# EAGLE design workshop (EAGLE 7.3.0)
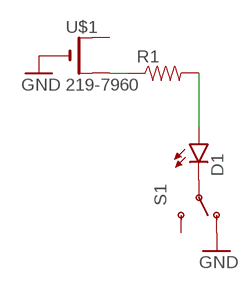
[diagram p0: schematic, sheet 1]

## Parts
D1  LED10MM  [LED10MM]
R1  RESISTORKIT  [AXIAL-0.3-KIT]
S1  SWITCH-SPDT-1  [MHS122-1]
U$1  219-7960  CR2032THM  [CR2032-THRU]

## Nets
GND: S1.1(O) U$1.-
N$1: D1.A R1.P$2
N$2: D1.C S1.2(P)
N$3: R1.P$1 U$1.+2(+1)
Unconnected: S1.3(S) U$1.+1(+)

## Library data of the parts
D1 = SparkFun-LED:LED: LEDs Standard schematic elements and footprints for 5mm, 3mm, 1206, and 0603 sized LEDs. 5mm - Spark Fun Electronics SKU : COM-00529 (and others)
R1 = SparkFun-Passives:RESISTOR: Resistor Basic schematic elements and footprints for 0603, 1206, and PTH resistors.
S1 = lio:SWITCH-SPDT: SPDT Switch Simple slide switch, Spark Fun Electronics SKU : COM-00102 DPDT SMT slide switch, AYZ0202, SWCH-08179
U$1 = adafruit:CR2032

## Net classes
0 default: width 1 mm

## Board
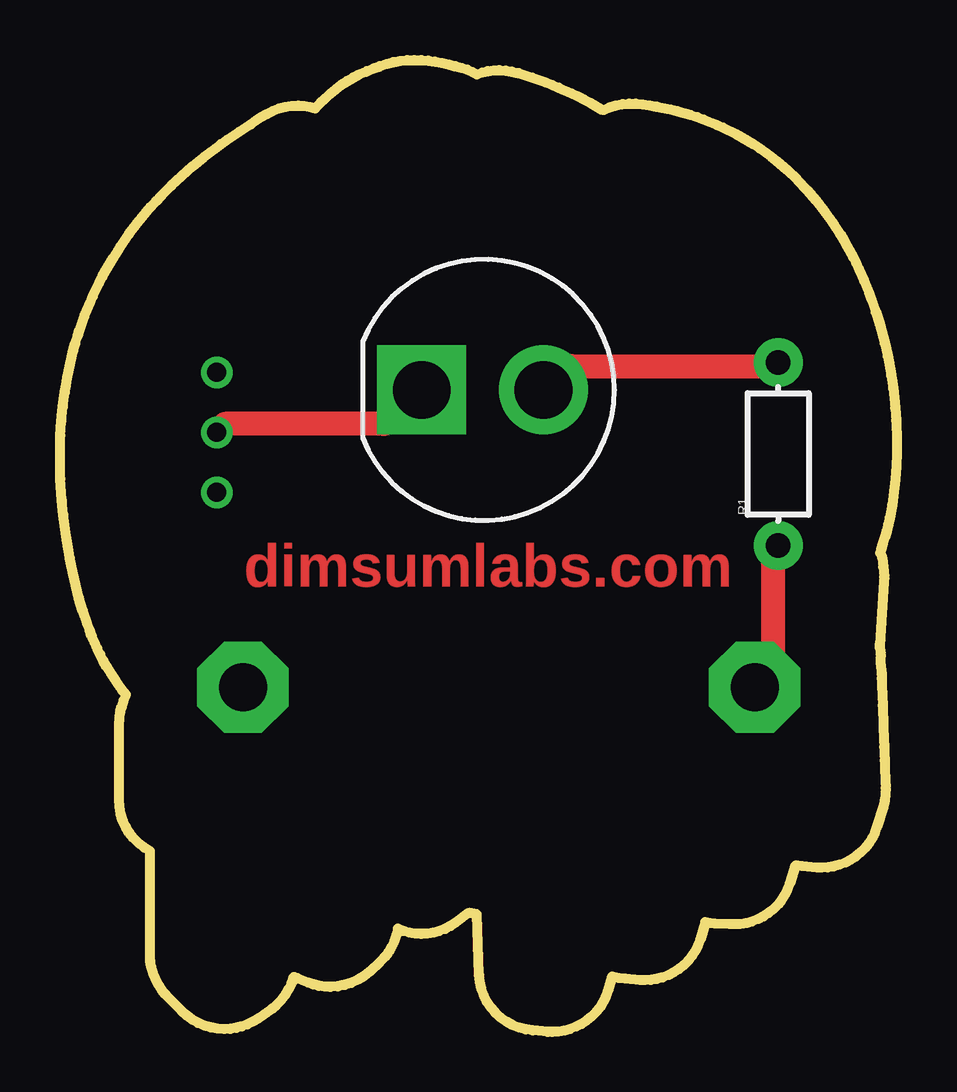
[diagram p1: board, top side]
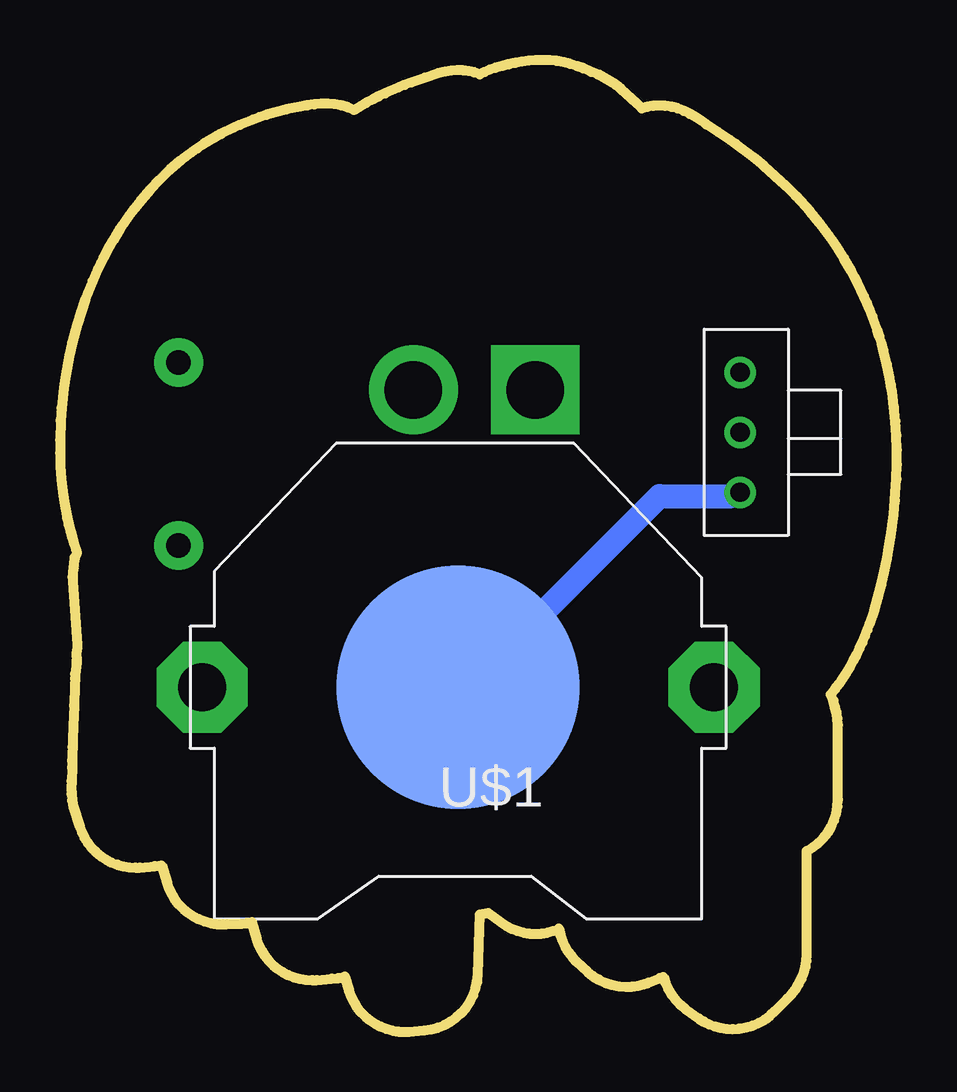
[diagram p2: board, bottom side, seen from below]

Size 34.89 x 40.49 mm. Coordinates in mm from the lower left corner, seen from the top.
Outline: 34.32,19.37 34.35,19.16 34.36,18.95 34.35,18.74 34.17,16.13 34.17,16.01 34.21,15.74 34.2,15.47 34.2,15.38 34.26,14.9 34.26,14.72 34.27,14.43 34.3,13.59 34.33,12.72 34.35,12.16 34.36,11.87 34.37,11.59 34.38,11.3 34.39,11.02 34.41,10.44 34.42,10.16 34.41,9.9 34.38,9.64 34.33,9.38 34.06,8.54 33.97,8.3 33.86,8.07 33.72,7.85 33.56,7.65 33.38,7.47 33.18,7.31 32.97,7.17 32.74,7.05 32.5,6.96 32.25,6.89 32,6.85 31.74,6.84 31.56,6.84 30.93,6.9 30.66,6.93 30.42,6.18 30.33,5.94 30.22,5.71 30.08,5.49 29.92,5.29 29.74,5.11 29.54,4.95 29.33,4.81 29.1,4.69 28.86,4.6 28.61,4.53 28.36,4.49 28.1,4.48 27.92,4.48 27.29,4.51 27.09,4.53 26.9,4.57 26.69,3.85 26.6,3.61 26.49,3.38 26.35,3.16 26.19,2.96 26.01,2.78 25.81,2.62 25.6,2.48 25.37,2.36 25.13,2.27 24.88,2.2 24.63,2.16 24.37,2.15 24.19,2.15 23.56,2.21 23.29,2.24 23.02,2.3 22.84,1.7 22.75,1.46 22.64,1.23 22.5,1.01 22.34,0.81 22.16,0.63 21.96,0.47 21.75,0.33 21.52,0.21 21.28,0.12 21.03,0.05 20.78,0.01 20.52,0 20.34,0 19.71,0.06 19.42,0.1 19.14,0.17 18.87,0.28 18.61,0.42 18.37,0.59 18.15,0.79 17.96,1.01 17.8,1.25 17.67,1.51 17.57,1.79 17.5,2.08 17.47,2.37 17.38,4.89 17.04,4.95 16.5,4.56 16.29,4.41 16.06,4.29 15.82,4.2 15.57,4.13 15.32,4.09 15.06,4.08 14.81,4.09 14.56,4.13 14.32,4.2 14.09,4.3 14.03,4.04 13.94,3.79 13.83,3.55 13.69,3.32 13.53,3.11 13.35,2.92 12.9,2.5 12.67,2.32 12.42,2.17 12.15,2.04 11.87,1.95 11.58,1.89 11.28,1.87 11.04,1.88 10.8,1.91 10.57,1.97 10.35,2.05 9.89,2.23 9.74,2.29 9.65,2.03 9.53,1.78 9.39,1.54 9.22,1.32 9.03,1.12 8.82,0.94 8.25,0.55 8.04,0.42 7.82,0.31 7.59,0.22 7.35,0.16 7.1,0.12 6.85,0.11 6.57,0.13 6.29,0.18 6.02,0.26 5.76,0.37 5.51,0.51 5.28,0.68 5.07,0.87 4.91,1.04 4.57,1.38 4.41,1.55 4.24,1.75 4.1,1.97 3.98,2.2 3.88,2.44 3.81,2.69 3.77,2.95 3.76,3.21 3.76,7.53 3.51,7.68 3.28,7.86 3.07,8.07 2.89,8.3 2.74,8.55 2.62,8.81 2.53,9.09 2.48,9.38 2.46,9.67 2.46,12.79 2.48,13.06 2.52,13.33 2.58,13.54 2.65,13.8 2.76,14.05 2.58,14.27 2.41,14.5 2.25,14.73 1.95,15.21 1.81,15.46 1.68,15.71 1.56,15.96 1.44,16.22 1.33,16.48 1.23,16.74 1.13,17.01 0.95,17.55 0.79,18.09 0.65,18.63 0.53,19.17 0.41,19.75 0.36,20.04 0.26,20.64 0.14,21.54 0.08,22.14 0.02,23.04 0,23.64 0,24.24 0.02,24.84 0.06,25.44 0.12,26.04 0.2,26.64 0.25,26.94 0.3,27.23 0.42,27.81 0.56,28.39 0.64,28.68 0.73,28.97 0.82,29.25 1.02,29.81 1.13,30.09 1.25,30.37 1.37,30.64 1.63,31.18 1.77,31.45 1.91,31.71 2.21,32.23 2.53,32.73 2.7,32.98 2.87,33.22 3.23,33.7 3.61,34.16 3.81,34.39 4.01,34.61 4.22,34.83 4.64,35.25 4.86,35.46 5.3,35.86 5.53,36.06 5.99,36.44 6.71,36.98 6.95,37.15 7.45,37.49 7.95,37.81 8.17,37.97 8.4,38.12 8.64,38.25 8.88,38.37 9.13,38.47 9.39,38.54 9.66,38.58 9.93,38.59 10.17,38.58 10.41,38.54 10.64,38.47 10.84,38.68 11.05,38.88 11.27,39.08 11.49,39.27 11.72,39.45 11.96,39.61 12.21,39.76 12.47,39.89 12.74,40 12.8,40.03 13.07,40.14 13.34,40.24 13.62,40.33 13.9,40.4 14.19,40.45 14.48,40.48 14.77,40.49 15.06,40.48 15.35,40.46 15.63,40.42 15.91,40.37 16.19,40.31 16.47,40.24 16.75,40.16 16.97,40.09 17.18,40 17.38,39.89 17.61,39.97 17.84,40.03 18.08,40.06 18.32,40.07 18.58,40.05 18.83,40.01 19.12,39.94 19.68,39.76 20.24,39.56 20.52,39.45 20.79,39.34 21.33,39.1 21.6,38.97 21.86,38.84 22.12,38.7 22.64,38.4 22.9,38.52 23.17,38.6 23.45,38.65 23.73,38.67 24,38.67 24.29,38.64 24.58,38.6 24.87,38.55 25.45,38.43 25.73,38.36 26.29,38.2 26.57,38.11 26.84,38.01 27.38,37.79 27.65,37.67 28.17,37.41 28.43,37.27 28.93,36.97 29.17,36.81 29.41,36.64 29.64,36.47 29.87,36.29 30.31,35.91 30.73,35.51 31.13,35.09 31.51,34.65 31.87,34.19 32.21,33.71 32.37,33.47 32.53,33.22 32.67,32.99 32.81,32.75 33.07,32.27 33.19,32.03 33.31,31.78 33.53,31.28 33.73,30.78 33.83,30.52 34.01,30 34.17,29.48 34.38,28.7 34.5,28.16 34.65,27.35 34.73,26.81 34.82,26 34.86,25.46 34.89,24.65 34.89,24.11 34.87,23.57 34.83,23.03 34.77,22.49 34.69,21.95 34.59,21.41 34.53,21.14 34.46,20.87 34.39,20.61 34.31,20.35 34.22,20.09 34.19,19.94 34.28,19.76 34.31,19.55 34.32,19.37
Copper layers (1*16): Top 0.035mm / dielectric 1.5mm / Bottom 0.035mm
Design rules "default": minimum track width 10mil, minimum drill 24mil, track to track 8mil, track to pad 8mil, pad to pad 8mil, via to via 8mil, smd to smd 8mil, copper to edge 40mil, drill to drill 8mil, minimum pad ring 10mil, minimum via ring 8mil, stop-mask expansion 4mil, vias tented up to drill 0mil, thermal gap 10mil

### Footprints (pad centres in the part's own frame; a part is rotated, then mirrored left to right if it is on the bottom)
LED10MM = drill 2.4 pad 3.7: A 2.54,0 | drill 2.4 pad 3.7 square: C -2.54,0
AXIAL-0.3-KIT = drill 1.016 pad 2.032: P$1 -3.81,0; P$2 3.81,0
MHS122-1 = drill 0.8: 1 -2.5,0; 2 0,0; 3 2.5,0
CR2032-THRU = drill 2 pad 3.81 octagon: +1 -10.668,0; +2 10.668,0 | smd 10.16 x 10.16: - 0,0

### Placement (x,y rotation side)
D1  17.62,26.75 0 top
R1  29.95,24.07 90 top
S1  6.54,24.98 90 bottom
U$1  18.3,14.36 180 bottom

### Tracks (layer width: path | path; a pad name or v marks a point on that pad's centre or on a via)
GND
  Bottom 1: S1.1 6.88,22.32 9.89,22.32 17.71,14.5 U$1.-
N$1
  Top 1: R1.P$2 29.74,27.73 21.32,27.73 20.72,27.13 D1.A
N$2
  Top 1: S1.2 6.88,25.32 13.5,25.32 14.7,26.53 D1.C
N$3
  Top 1: R1.P$1 29.74,19.91 29.74,15.1 29.14,14.5 U$1.+2

### Text on the board
Top: dimsumlabs.com
tStop: dimsumlabs.com